# Altium schematic sheet POWER.SchDoc
size A2
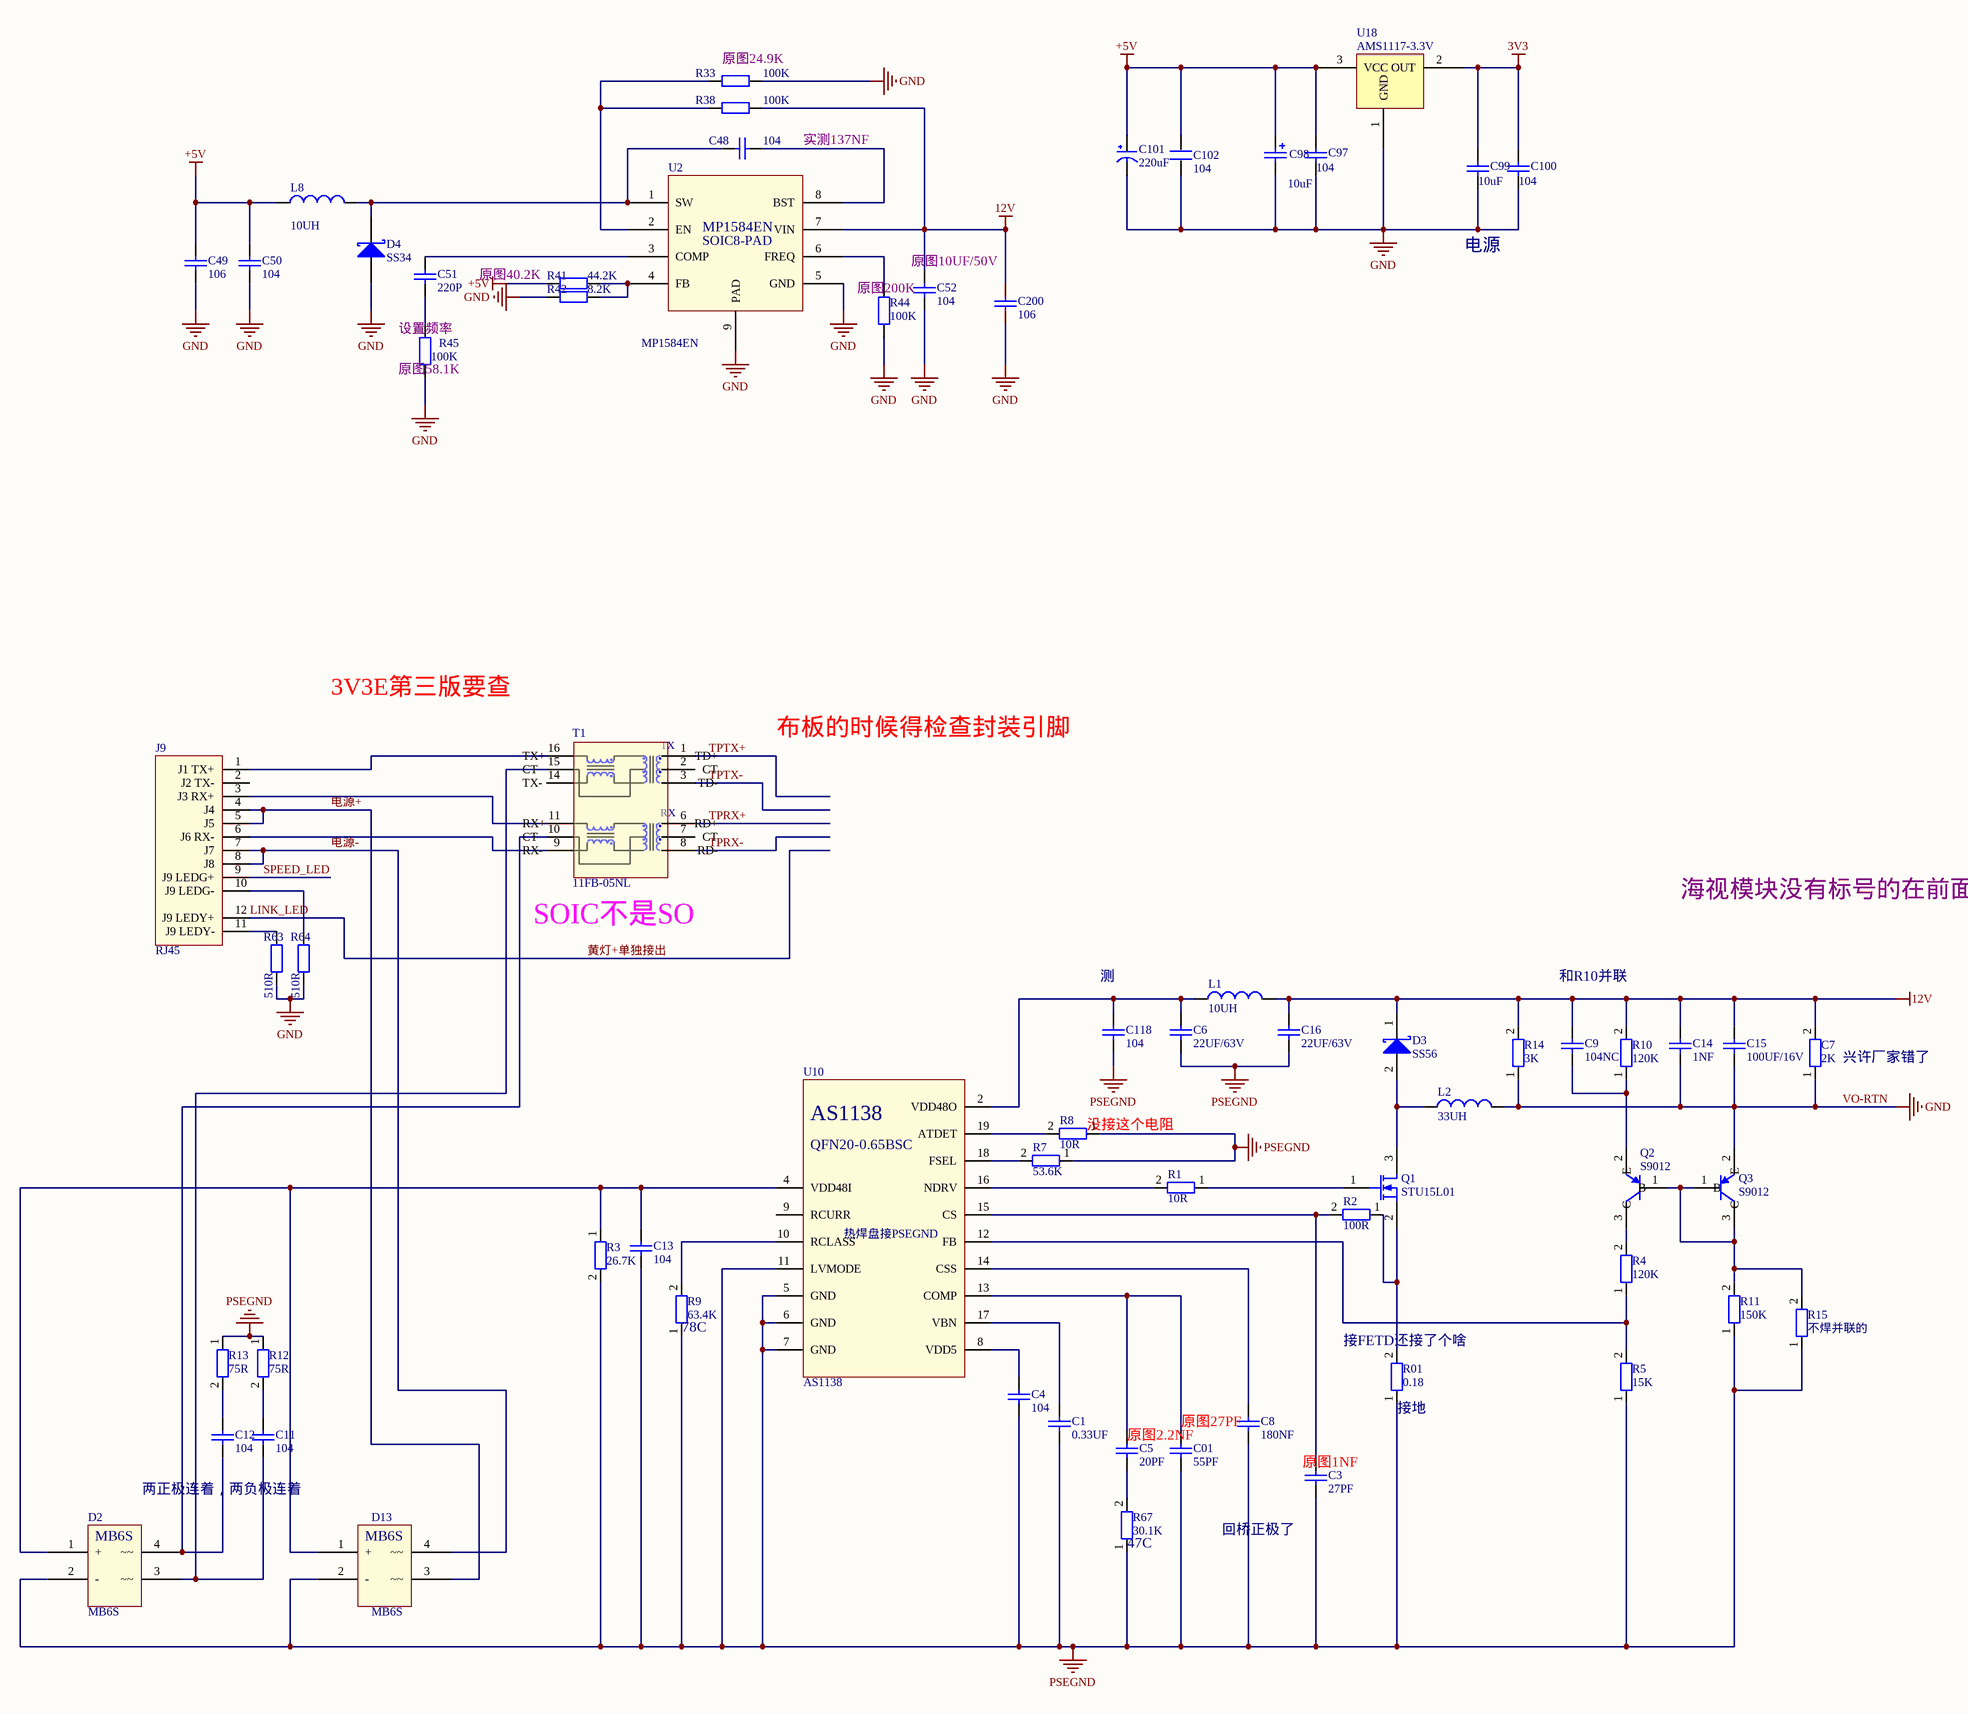
[diagram p0: POWER.SchDoc]

## Parts
C01  55PF  [0603T]
C1  0.33UF  [0603T]
C3  27PF  [0603T]
C4  104  [0603T]
C5  20PF  [0603T]
C6  22UF/63V  [CAP-SIP]
C7  2K  [0603T]
C8  180NF  [0603T]
C9  104NC  [0603T]
C11  104  [0603T]
C12  104  [0603T]
C13  104  [0603T]
C14  1NF  [1206]
C15  100UF/16V  [CAP-SIP]
C16  22UF/63V  [CAP-SIP]
C48  104  [0603T]
C49  106  [1206]
C50  104  [0603T]
C51  220P  [0603T]
C52  104  [0603T]
C97  104  [0603T]
C98  10uF  [CAP-SIP]
C99  10uF  [0603T]
C100  104  [0603T]
C101  220uF  [7343E型]
C102  104  [0603T]
C118  104  [0603T]
C200  106  [1206]
D2  MB6S  [SOP-4]
D3  SS56  [SMC]
D4  SS34  [SMB]
D13  MB6S  [SOP-4]
J9  RJ45  [RJ45]
L1  10UH  [4*4电感]
L2  33UH  [L10*10]
L8  value 10UH  [6*6电感]  (hidden comment: Inductor)
Q1  STU15L01  [TO-252AA(D-PAK)]
Q2  S9012  [SOT-23]
Q3  S9012  [SOT-23]
R01  0.18  [3.5X2.8X1.9]
R1  10R  [0603T]
R2  100R  [0603T]
R3  26.7K  [0603T]
R4  120K  [0603T]
R5  15K  [0603T]
R7  53.6K  [0603T]
R8  10R  [0603T]
R9  63.4K  [0603T]
R10  120K  [0603T]
R11  150K  [0603T]
R12  75R  [0603T]
R13  75R  [0603T]
R14  3K  [0603T]
R15  不焊并联的  [0603T]
R33  100K  [0603T]
R38  100K  [0603T]
R41  44.2K  [0603T]
R42  8.2K  [0603T]
R44  100K  [0603T]
R45  100K  [0603T]
R63  value 510R  [0603T]  (hidden comment: Res)
R64  value 510R  [0603T]  (hidden comment: Res)
R67  30.1K  [0603T]
T1  11FB-05NL  [SOIC16]
U2  MP1584EN  [SOIC8-PAD]
U10  AS1138  [QFN20-0.65BSC-PAD]
U18  AMS1117-3.3V  [SOT-223]

## Nets
3V3: C99.2 C100.2 U18.2(OUT)
12V: C7.2 C9.1 C14.2 C15.2 C16.2 C52.2 C200.2 D3.1(K) L1.2 R10.2 R14.2 R38.2 U2.7(VIN)
+5V: C49.2 C50.2 C97.2 C98.1 C101.1(VCC) C102.2 L8.1 R41.2 U18.3(VCC)
PSEGND: C01.2 C1.2 C3.2 C4.2 C6.1 C8.2 C13.2 C16.1 C118.1 D2.2(-) D13.2(-) R01.1 R3.2 R5.1 R7.1 R8.1 R9.1 R11.1 R12.1 R13.1 R15.1 R67.1 U10.5(GND) U10.6(GND) U10.7(GND) U10.11(LVMODE)
VO-RTN: C7.1 C14.1 C15.1 C49.1 C50.1 C52.1 C97.1 C98.2 C99.1 C100.1 C101.2(GND) C102.1 C200.1 D4.1(A) L2.2 Q3.2(E) R14.1 R33.2 R42.2 R44.2 R45.2 R63.2 R64.2 U2.5(GND) U2.9(PAD) U18.1(GND)  [also labelled GND]
LINK_LED: J9.12(J9_LEDY+)  [also labelled 黄灯+单独接出]
SPEED_LED: J9.9(J9_LEDG+)
TPRX+: T1.6(RD+)
TPRX-: T1.8(RD-)
TPTX+: T1.1(TD+)
TPTX-: T1.3(TD-)
电源+: D13.3(~~) J9.4(J4) J9.5(J5)
电源-: D13.4(~~) J9.7(J7) J9.8(J8)
NetC01_1: C01.1 C5.1 U10.13(COMP)
NetC1_1: C1.1 U10.17(VBN)
NetC3_1: C3.1 R2.2 U10.15(CS)
NetC4_1: C4.1 U10.8(VDD5)
NetC5_2: C5.2 R67.2
NetC6_2: C6.2 C118.2 L1.1 U10.2(VDD48O)
NetC8_1: C8.1 U10.14(CSS)
NetC9_2: C9.2 Q2.2(E) R10.1
NetC11_1: C11.1 R12.2
NetC11_2: C11.2 D2.3(~~) T1.15(CT)
NetC12_1: C12.1 R13.2
NetC12_2: C12.2 D2.4(~~) T1.10(CT)
NetC13_1: C13.1 D2.1(+) D13.1(+) R3.1 U10.4(VDD48I)
NetC48_1: C48.1 U2.8(BST)
NetC48_2: C48.2 D4.2(K) L8.2 U2.1(SW)
NetC51_1: C51.1 R45.1
NetC51_2: C51.2 U2.3(COMP)
NetD3_2: D3.2(A) L2.1 Q1.3(D)
NetJ9_1: J9.1(J1_TX+) T1.16(TX+)
NetJ9_3: J9.3(J3_RX+) T1.11(RX+)
NetJ9_6: J9.6(J6_RX-) T1.9(RX-)
NetJ9_10: J9.10(J9_LEDG-) R64.1
NetJ9_11: J9.11(J9_LEDY-) R63.1
NetQ1_1: Q1.1(G) R1.1
NetQ1_2: Q1.2(S) R01.2 R2.1
NetQ2_1: Q2.1(B) Q3.1(B) Q3.3(C) R11.2 R15.2
NetQ2_3: Q2.3(C) R4.2
NetR1_2: R1.2 U10.16(NDRV)
NetR4_1: R4.1 R5.2 U10.12(FB)
NetR7_2: R7.2 U10.18(FSEL)
NetR8_2: R8.2 U10.19(ATDET)
NetR9_2: R9.2 U10.10(RCLASS)
NetR33_1: R33.1 R38.1 U2.2(EN)
NetR41_1: R41.1 R42.1 U2.4(FB)
NetR44_1: R44.1 U2.6(FREQ)

Not connected (* = marked no-connect by the designer): J9 2(J2_TX-); T1 2(CT) 7(CT) 14(TX-); U10 9(RCURR)

## Notes on the sheet
- (near R33) 原图24.9K
- 实测137NF
- 原图40.2K
- (near C52) 原图10UF/50V
- 电源
- (near R45) 设置频率
- (near R44) 原图200K
- (near R45) 原图58.1K
- 3V3E第三版要查
- 布板的时候得检查封装引脚
- (near T1) SOIC不是SO
- 海视模块没有标号的在前面添0
- (near C118) 测
- 和R10并联
- (near C7) 兴许厂家错了
- (near R8) 没接这个电阻
- (near U10) 热焊盘接PSEGND
- (near R9) 78C
- (near R01) 接FETD还接了个啥
- 原图27PF
- (near R01) 接地
- 两正极连着，两负极连着
- 原图2.2NF
- (near C3) 原图1NF
- (near R67) 47C
- 回桥正极了
- (in symbol 11FB-05NL) TX; RX
- (in symbol AS1138) QFN20-0.65BSC
- (in symbol MP1584EN顺序) SOIC8-PAD

## Library data of the parts
C01 C1 C3-C6 C8 C9 C11-C16 C48-C52 C118 C200 = Cap: Capacitor; Value: 100pF; Published: 8-Jun-2000; LatestRevisionDate: 17-Jul-2002; LatestRevisionNote: Re-released for DXP Platform.; PackageReference: RAD-0.3; Publisher: Altium Limited; PackageDescription: Radial Cap, Thru-Hole; 2 Leads; 0.3 in Pin Spacing
C7 R01 R1-R5 R7-R15 R33 R38 R41 R42 R44 R45 R67 = Res2: Resistor; Value: 1K; Published: 8-Jun-2000; LatestRevisionDate: 17-Jul-2002; LatestRevisionNote: Re-released for DXP Platform.; PackageReference: AXIAL-0.4; Publisher: Altium Limited; PackageDescription: Axial Device, Thru-Hole; 2 Leads; 0.4 in Pin Spacing
C97 C100 = Cap: Capacitor; Value: 100nF; Published: 8-Jun-2000; LatestRevisionDate: 17-Jul-2002; LatestRevisionNote: Re-released for DXP Platform.; PackageReference: RAD-0.3; Publisher: Altium Limited; PackageDescription: Radial Cap, Thru-Hole; 2 Leads; 0.3 in Pin Spacing
C98 = Cap Pol2: Polarized Capacitor (Axial); Published: 8-Jun-2000; LatestRevisionDate: 17-Jul-2002; LatestRevisionNote: Re-released for DXP Platform.; PackageReference: POLAR0.8; Publisher: Altium Limited; PackageDescription: Polarized Capacitor; 2 Leads; Value: 10uF
C99 = Cap: Capacitor; Published: 8-Jun-2000; LatestRevisionDate: 17-Jul-2002; LatestRevisionNote: Re-released for DXP Platform.; PackageReference: RAD-0.3; Publisher: Altium Limited; PackageDescription: Radial Cap, Thru-Hole; 2 Leads; 0.3 in Pin Spacing; Value: 10uF
C101 = CAP
C102 = C
D3 = Diode 10TQ035: Schottky Rectifier; Note: Terminal 2 is the TAB and is electrically connected to the cathode; Published: 8-Jun-2000; LatestRevisionDate: 17-Jul-2002; LatestRevisionNote: Re-released for DXP Platform.; DatasheetVersion: PD-2.057B; PackageVersion: Feb-1998; PackageReference: TO-220AC; Publisher: Altium Limited; PackageDescription: TO, Thru-Hole, Vertical, Heatsink Mounted; 3 In-Line Leads (1 Absent); Pitch 2.54 mm; ComponentLink1Description: Manufacturer Link; ComponentLink1URL: http://www.irf.com/; ComponentLink2Description: Datasheet; ComponentLink2URL: http://www.irf.com/product-info/datasheets/data/10tq.pdf
D4 = D Schottky: Schottky Diode; Published: 8-Jun-2000; LatestRevisionDate: 17-Jul-2002; LatestRevisionNote: Re-released for DXP Platform.; PackageReference: SMB; Publisher: Altium Limited; PackageDescription: DO-214-AA/SMB; 2 C-Bend Leads; Body 5.3 x 3.6 mm, inc. leads (LxW); Code_JEDEC: DO-214-AA
L1 L8 = Inductor: Code_IEC: 1005; Published: 8-Jun-2000; LatestRevisionDate: 29-May-2009; LatestRevisionNote: IPC-7351 Footprint Added.; PackageReference: 0402-A; Publisher: Altium Limited; PackageDescription: Chip Inductor; Code_JEITA: 0402
  L1: Value: 10UH
L2 = Inductor: Code_IEC: 1005; Value: 10UH; Published: 8-Jun-2000; LatestRevisionDate: 29-May-2009; LatestRevisionNote: IPC-7351 Footprint Added.; PackageReference: 0402-A; Publisher: Altium Limited; PackageDescription: Chip Inductor; Code_JEITA: 0402
Q1 = MOSFET-N: N-Channel MOSFET; Published: 8-Jun-2000; LatestRevisionDate: 17-Jul-2002; LatestRevisionNote: Re-released for DXP Platform.; PackageVersion: 1995/1996; PackageReference: E3; Publisher: Altium Limited; PackageDescription: TO, Flat Index; 3 In-Line, Axial Leads; Body Dia. 4.6mm; Lead Dia. 0.5 mm (max)
Q2 Q3 = S9012: NPN General Purpose Amplifier; Published: 8-Jun-2000; LatestRevisionDate: 15-Jan-2003; LatestRevisionNote: PCB Footprint 'BCY-W3/D4.7' replaced; DatasheetVersion: 1997; PackageVersion: Sep-1998; PackageReference: TO-92A; Publisher: Altium Limited; PackageDescription: TO, Flat Index; 3 In-Line, Axial Leads; Body Dia. 4.5mm; Leads 0.51 x 0.48 mm (max); ComponentLink1Description: Manufacturer Link; ComponentLink1URL: http://www.fairchildsemi.com/; ComponentLink2Description: Datasheet; ComponentLink2URL: http://www.fairchildsemi.com/ds/2N%2F2N3904.pdf
R63 R64 = Res2: Resistor; Published: 8-Jun-2000; LatestRevisionDate: 17-Jul-2002; LatestRevisionNote: Re-released for DXP Platform.; PackageReference: AXIAL-0.4; Publisher: Altium Limited; PackageDescription: Axial Device, Thru-Hole; 2 Leads; 0.4 in Pin Spacing
U2 = MP1584EN顺序
U18 = 11